# Altium project STM32F407VG.PrjPcb
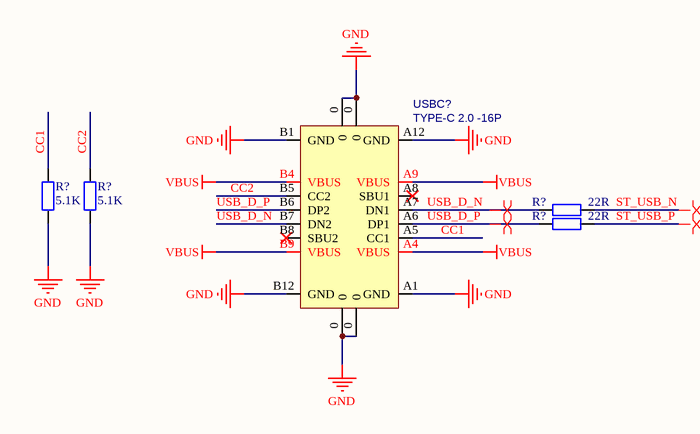
[diagram p0: Power_1.SchDoc]
8 sheets, 75 parts. Net scope: global (net labels, ports and power ports of the same name join across sheets).
Board files: STM32F407VG.PcbDoc, 板框.PcbDoc
Sheets:
  Power_1.SchDoc
  Power_2.SchDoc
  STM32F407VG_A.SchDoc
  STM32F407VG_B.SchDoc
  Flash.SchDoc
  SDCard.SchDoc
  ICM20608.SchDoc
  LCD_ADS131A04.SchDoc

## Sheet Power_1.SchDoc
size A4; SheetNumber: 1; SheetTotal: 8

### Parts
(Parts that share a designator on the sheet are numbered #1, #2 ... from top to bottom, then left to right.)
R?#1  22R  [R0402_L]
R?#2  5.1K  [R0402_L]
R?#3  5.1K  [R0402_L]
R?#4  22R  [R0402_L]
USBC?  TYPE-C 2.0 -16P  [USB-C-SMD_16P]

### Nets
GND: R?#2.1 R?#3.1 USBC?.0 USBC?.A1(GND) USBC?.A12(GND) USBC?.B1(GND) USBC?.B12(GND)
VBUS: USBC?.A4(VBUS) USBC?.A9(VBUS) USBC?.B4(VBUS) USBC?.B9(VBUS)
CC1: R?#2.2 USBC?.A5(CC1)
CC2: R?#3.2 USBC?.B5(CC2)
ST_USB_N: R?#1.2
ST_USB_P: R?#4.2
USB_D_N: R?#1.1 USBC?.A7(DN1) USBC?.B7(DN2)
USB_D_P: R?#4.1 USBC?.A6(DP1) USBC?.B6(DP2)

Not connected (* = marked no-connect by the designer): USBC? A8(SBU1)* B8(SBU2)*

### Layout directives
differential pair: ST_USB_N, ST_USB_P, USB_D_N, USB_D_P

### Library data of the parts
R?#1-R?#4 = R: 贴片电阻; 联系卖家，免费查找封装: 唯一出售店铺网址https://shop463601444.taobao.com; BOM名称: 贴片电阻
USBC? = USB2.0_Type-C_16Pin: USB2.0_Type-C_16Pin母座; 联系卖家 免费查找封装: 唯一出售店铺网址https://shop463601444.taobao.com; 联系卖家 免费技术支持: 封装库来自淘宝卖家ID：黄晶宝石

## Sheet Power_2.SchDoc
size A4; SheetNumber: 2; SheetTotal: 8
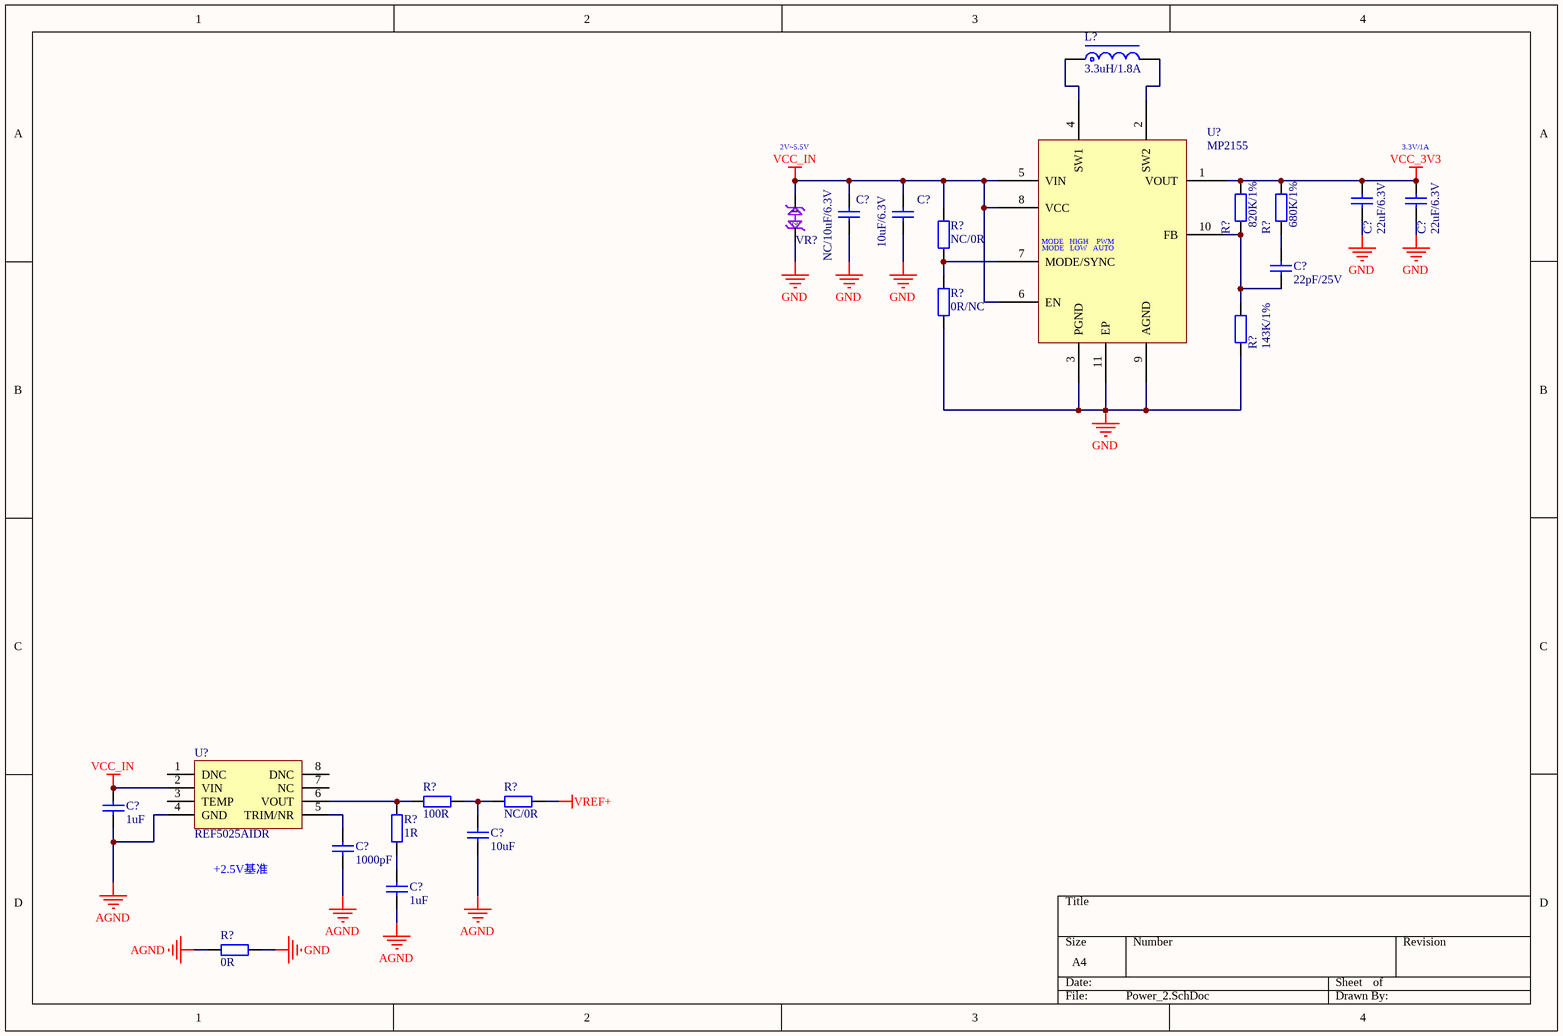
[diagram p1: Power_2.SchDoc]

### Parts
(Parts that share a designator on the sheet are numbered #1, #2 ... from top to bottom, then left to right.)
C?#1  22uF/6.3V  [C0603_L]
C?#2  22uF/6.3V  [C0603_L]
C?#3  NC/10uF/6.3V  [C0603_L]
C?#4  10uF/6.3V  [C0603_L]
C?#5  22pF/25V  [C0402_L]
C?#6  1uF  [C0402_L]
C?#7  10uF  [C0603_L]
C?#8  1000pF  [C0603_L]
C?#9  1uF  [C0402_L]
L?  3.3uH/1.8A  [NR2520]
R?#5  820K/1%  [R0402_L]
R?#6  680K/1%  [R0402_L]
R?#7  NC/0R  [R0402_L]
R?#8  0R/NC  [R0402_L]
R?#9  143K/1%  [R0402_L]
R?#10  100R  [R0402_L]
R?#11  NC/0R  [R0402_L]
R?#12  1R  [R0402_L]
R?#13  0R  [R0402_L]
U?#1  MP2155  [QFN10(3mmX3mm)]
U?#2  REF5025AIDR  [SOIC-8L]
VR?#1  UAD8C05L01  [SOD882]  (value not drawn)

### Nets
AGND: C?#6.1 C?#7.1 C?#8.1 C?#9.1 R?#13.1 U?#2.4(GND)
GND: C?#1.1 C?#2.1 C?#3.1 C?#4.1 R?#8.1 R?#9.1 R?#13.2 U?#1.3(PGND) U?#1.9(AGND) U?#1.11(EP) VR?#1.2
VCC_3V3: C?#1.2 C?#2.2 R?#5.2 R?#6.2 U?#1.1(VOUT)
VCC_IN: C?#3.2 C?#4.2 C?#6.2 R?#7.2 U?#1.5(VIN) U?#1.6(EN) U?#1.8(VCC) U?#2.2(VIN) VR?#1.1
VREF+: R?#11.2
NetC?#5_1: C?#5.1 R?#5.1 R?#9.2 U?#1.10(FB)
NetC?#5_2: C?#5.2 R?#6.1
NetC?#7_2: C?#7.2 R?#10.2 R?#11.1
NetC?#8_2: C?#8.2 U?#2.5(TRIM/NR)
NetC?#9_2: C?#9.2 R?#12.1
NetL?_1: L?.1 U?#1.4(SW1)
NetL?_2: L?.2 U?#1.2(SW2)
NetR?#7_1: R?#7.1 R?#8.2 U?#1.7(MODE/SYNC)
NetR?#10_1: R?#10.1 R?#12.2 U?#2.6(VOUT)

Not connected (* = marked no-connect by the designer): U?#2 1(DNC) 3(TEMP) 7(NC) 8(DNC)

### Notes on the sheet
- 2V~5.5V
- (near C?#2) 3.3V/1A
- (near U?#1) MODE   HIGH    PWM
- (near U?#1) MODE   LOW   AUTO
- +2.5V基准

### Library data of the parts
C?#1-C?#9 = C: 贴片电容; BOM名称: 无极性贴片电容; 联系卖家，免费查找封装: 唯一出售店铺网址https://shop463601444.taobao.com
L? = L-NR: 太诱-NR磁胶电感; BOM名称: NR磁胶电感; 联系卖家，免费查找封装: 唯一出售店铺网址https://shop463601444.taobao.com
R?#5-R?#13 = R: as R?#1 on sheet Power_1; BOM名称: 贴片电阻
U?#1 = MP2155: 高效、低静态电流的Buck-Boost变换器
U?#2 = REF5025AIDR: 3uVpp/V噪声 3ppm/℃漂移 电压基准 0.05%

## Sheet STM32F407VG_A.SchDoc
size A4; SheetNumber: 3; SheetTotal: 8
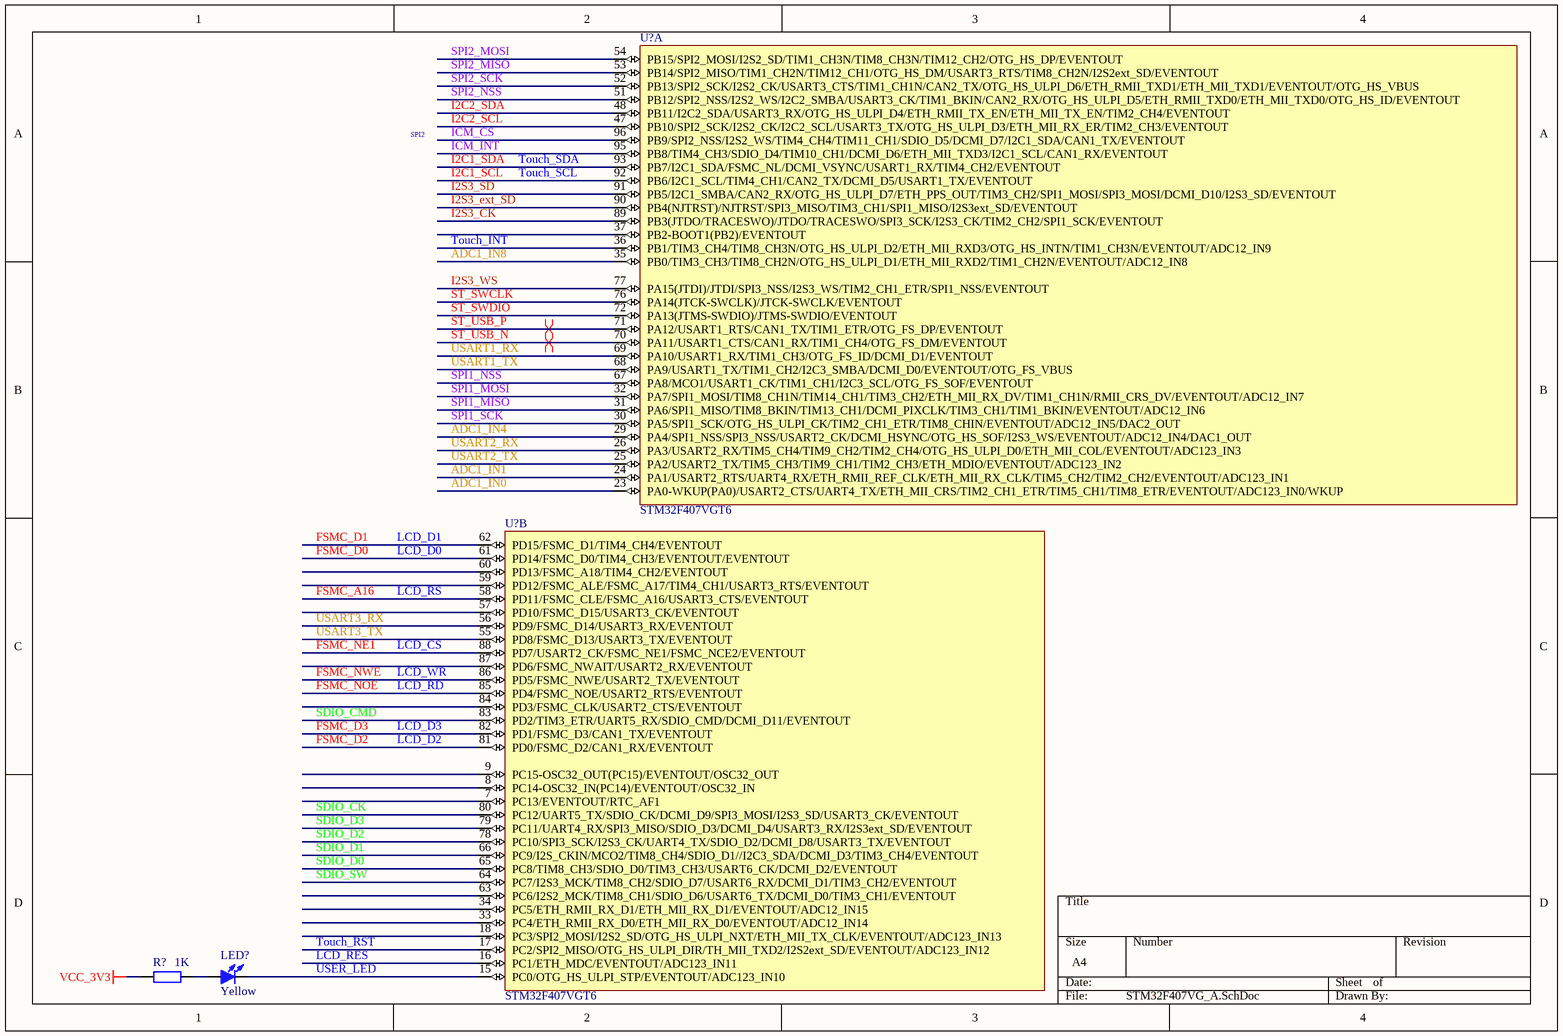
[diagram p2: STM32F407VG_A.SchDoc]

### Parts
(Parts that share a designator on the sheet are numbered #1, #2 ... from top to bottom, then left to right.)
LED?  Yellow  [LED0402]
R?#14  1K  [R0805_L]
U?#3  STM32F407VGT6  [LQFP100_L]  (part A of 5)
U?#4  STM32F407VGT6  [LQFP100_L]  (part B of 5)

### Nets
VCC_3V3: R?#14.1
ADC1_IN0: U?#3.23(PA0-WKUP(PA0)/USART2_CTS/UART4_TX/ETH_MII_CRS/TIM2_CH1_ETR/TIM5_CH1/TIM8_ETR/EVENTOUT/ADC123_IN0/WKUP)
ADC1_IN1: U?#3.24(PA1/USART2_RTS/UART4_RX/ETH_RMII_REF_CLK/ETH_MII_RX_CLK/TIM5_CH2/TIM2_CH2/EVENTOUT/ADC123_IN1)
ADC1_IN4: U?#3.29(PA4/SPI1_NSS/SPI3_NSS/USART2_CK/DCMI_HSYNC/OTG_HS_SOF/I2S3_WS/EVENTOUT/ADC12_IN4/DAC1_OUT)
ADC1_IN8: U?#3.35(PB0/TIM3_CH3/TIM8_CH2N/OTG_HS_ULPI_D1/ETH_MII_RXD2/TIM1_CH2N/EVENTOUT/ADC12_IN8)
FSMC_A16: U?#4.58(PD11/FSMC_CLE/FSMC_A16/USART3_CTS/EVENTOUT)  [also labelled LCD_RS]
FSMC_D0: U?#4.61(PD14/FSMC_D0/TIM4_CH3/EVENTOUT/EVENTOUT)  [also labelled LCD_D0]
FSMC_D1: U?#4.62(PD15/FSMC_D1/TIM4_CH4/EVENTOUT)  [also labelled LCD_D1]
FSMC_D2: U?#4.81(PD0/FSMC_D2/CAN1_RX/EVENTOUT)  [also labelled LCD_D2]
FSMC_D3: U?#4.82(PD1/FSMC_D3/CAN1_TX/EVENTOUT)  [also labelled LCD_D3]
FSMC_NE1: U?#4.88(PD7/USART2_CK/FSMC_NE1/FSMC_NCE2/EVENTOUT)  [also labelled LCD_CS]
FSMC_NOE: U?#4.85(PD4/FSMC_NOE/USART2_RTS/EVENTOUT)  [also labelled LCD_RD]
FSMC_NWE: U?#4.86(PD5/FSMC_NWE/USART2_TX/EVENTOUT)  [also labelled LCD_WR]
I2C1_SCL: U?#3.92(PB6/I2C1_SCL/TIM4_CH1/CAN2_TX/DCMI_D5/USART1_TX/EVENTOUT)  [also labelled Touch_SCL]
I2C1_SDA: U?#3.93(PB7/I2C1_SDA/FSMC_NL/DCMI_VSYNC/USART1_RX/TIM4_CH2/EVENTOUT)  [also labelled Touch_SDA]
I2C2_SCL: U?#3.47(PB10/SPI2_SCK/I2S2_CK/I2C2_SCL/USART3_TX/OTG_HS_ULPI_D3/ETH_MII_RX_ER/TIM2_CH3/EVENTOUT)
I2C2_SDA: U?#3.48(PB11/I2C2_SDA/USART3_RX/OTG_HS_ULPI_D4/ETH_RMII_TX_EN/ETH_MII_TX_EN/TIM2_CH4/EVENTOUT)
I2S3_CK: U?#3.89(PB3(JTDO/TRACESWO)/JTDO/TRACESWO/SPI3_SCK/I2S3_CK/TIM2_CH2/SPI1_SCK/EVENTOUT)
I2S3_ext_SD: U?#3.90(PB4(NJTRST)/NJTRST/SPI3_MISO/TIM3_CH1/SPI1_MISO/I2S3ext_SD/EVENTOUT)
I2S3_SD: U?#3.91(PB5/I2C1_SMBA/CAN2_RX/OTG_HS_ULPI_D7/ETH_PPS_OUT/TIM3_CH2/SPI1_MOSI/SPI3_MOSI/DCMI_D10/I2S3_SD/EVENTOUT)
I2S3_WS: U?#3.77(PA15(JTDI)/JTDI/SPI3_NSS/I2S3_WS/TIM2_CH1_ETR/SPI1_NSS/EVENTOUT)
ICM_CS: U?#3.96(PB9/SPI2_NSS/I2S2_WS/TIM4_CH4/TIM11_CH1/SDIO_D5/DCMI_D7/I2C1_SDA/CAN1_TX/EVENTOUT)
ICM_INT: U?#3.95(PB8/TIM4_CH3/SDIO_D4/TIM10_CH1/DCMI_D6/ETH_MII_TXD3/I2C1_SCL/CAN1_RX/EVENTOUT)
LCD_RES: U?#4.16(PC1/ETH_MDC/EVENTOUT/ADC123_IN11)
SDIO_CK: U?#4.80(PC12/UART5_TX/SDIO_CK/DCMI_D9/SPI3_MOSI/I2S3_SD/USART3_CK/EVENTOUT)
SDIO_CMD: U?#4.83(PD2/TIM3_ETR/UART5_RX/SDIO_CMD/DCMI_D11/EVENTOUT)
SDIO_D0: U?#4.65(PC8/TIM8_CH3/SDIO_D0/TIM3_CH3/USART6_CK/DCMI_D2/EVENTOUT)
SDIO_D1: U?#4.66(PC9/I2S_CKIN/MCO2/TIM8_CH4/SDIO_D1//I2C3_SDA/DCMI_D3/TIM3_CH4/EVENTOUT)
SDIO_D2: U?#4.78(PC10/SPI3_SCK/I2S3_CK/UART4_TX/SDIO_D2/DCMI_D8/USART3_TX/EVENTOUT)
SDIO_D3: U?#4.79(PC11/UART4_RX/SPI3_MISO/SDIO_D3/DCMI_D4/USART3_RX/I2S3ext_SD/EVENTOUT)
SDIO_SW: U?#4.64(PC7/I2S3_MCK/TIM8_CH2/SDIO_D7/USART6_RX/DCMI_D1/TIM3_CH2/EVENTOUT)
SPI1_MISO: U?#3.31(PA6/SPI1_MISO/TIM8_BKIN/TIM13_CH1/DCMI_PIXCLK/TIM3_CH1/TIM1_BKIN/EVENTOUT/ADC12_IN6)
SPI1_MOSI: U?#3.32(PA7/SPI1_MOSI/TIM8_CH1N/TIM14_CH1/TIM3_CH2/ETH_MII_RX_DV/TIM1_CH1N/RMII_CRS_DV/EVENTOUT/ADC12_IN7)
SPI1_NSS: U?#3.67(PA8/MCO1/USART1_CK/TIM1_CH1/I2C3_SCL/OTG_FS_SOF/EVENTOUT)
SPI1_SCK: U?#3.30(PA5/SPI1_SCK/OTG_HS_ULPI_CK/TIM2_CH1_ETR/TIM8_CHIN/EVENTOUT/ADC12_IN5/DAC2_OUT)
SPI2_MISO: U?#3.53(PB14/SPI2_MISO/TIM1_CH2N/TIM12_CH1/OTG_HS_DM/USART3_RTS/TIM8_CH2N/I2S2ext_SD/EVENTOUT)
SPI2_MOSI: U?#3.54(PB15/SPI2_MOSI/I2S2_SD/TIM1_CH3N/TIM8_CH3N/TIM12_CH2/OTG_HS_DP/EVENTOUT)
SPI2_NSS: U?#3.51(PB12/SPI2_NSS/I2S2_WS/I2C2_SMBA/USART3_CK/TIM1_BKIN/CAN2_RX/OTG_HS_ULPI_D5/ETH_RMII_TXD0/ETH_MII_TXD0/OTG_HS_ID/EVENTOUT)
SPI2_SCK: U?#3.52(PB13/SPI2_SCK/I2S2_CK/USART3_CTS/TIM1_CH1N/CAN2_TX/OTG_HS_ULPI_D6/ETH_RMII_TXD1/ETH_MII_TXD1/EVENTOUT/OTG_HS_VBUS)
ST_SWCLK: U?#3.76(PA14(JTCK-SWCLK)/JTCK-SWCLK/EVENTOUT)
ST_SWDIO: U?#3.72(PA13(JTMS-SWDIO)/JTMS-SWDIO/EVENTOUT)
ST_USB_N: U?#3.70(PA11/USART1_CTS/CAN1_RX/TIM1_CH4/OTG_FS_DM/EVENTOUT)
ST_USB_P: U?#3.71(PA12/USART1_RTS/CAN1_TX/TIM1_ETR/OTG_FS_DP/EVENTOUT)
Touch_INT: U?#3.36(PB1/TIM3_CH4/TIM8_CH3N/OTG_HS_ULPI_D2/ETH_MII_RXD3/OTG_HS_INTN/TIM1_CH3N/EVENTOUT/ADC12_IN9)
Touch_RST: U?#4.17(PC2/SPI2_MISO/OTG_HS_ULPI_DIR/TH_MII_TXD2/I2S2ext_SD/EVENTOUT/ADC123_IN12)
USART1_RX: U?#3.69(PA10/USART1_RX/TIM1_CH3/OTG_FS_ID/DCMI_D1/EVENTOUT)
USART1_TX: U?#3.68(PA9/USART1_TX/TIM1_CH2/I2C3_SMBA/DCMI_D0/EVENTOUT/OTG_FS_VBUS)
USART2_RX: U?#3.26(PA3/USART2_RX/TIM5_CH4/TIM9_CH2/TIM2_CH4/OTG_HS_ULPI_D0/ETH_MII_COL/EVENTOUT/ADC123_IN3)
USART2_TX: U?#3.25(PA2/USART2_TX/TIM5_CH3/TIM9_CH1/TIM2_CH3/ETH_MDIO/EVENTOUT/ADC123_IN2)
USART3_RX: U?#4.56(PD9/FSMC_D14/USART3_RX/EVENTOUT)
USART3_TX: U?#4.55(PD8/FSMC_D13/USART3_TX/EVENTOUT)
USER_LED: LED?.2(K) U?#4.15(PC0/OTG_HS_ULPI_STP/EVENTOUT/ADC123_IN10)
NetLED?_1: LED?.1(A) R?#14.2

Not connected (* = marked no-connect by the designer): U?#3 37(PB2-BOOT1(PB2)/EVENTOUT); U?#4 7(PC13/EVENTOUT/RTC_AF1) 8(PC14-OSC32_IN(PC14)/EVENTOUT/OSC32_IN) 9(PC15-OSC32_OUT(PC15)/EVENTOUT/OSC32_OUT) 18(PC3/SPI2_MOSI/I2S2_SD/OTG_HS_ULPI_NXT/ETH_MII_TX_CLK/EVENTOUT/ADC123_IN13) 33(PC4/ETH_RMII_RX_D0/ETH_MII_RX_D0/EVENTOUT/ADC12_IN14) 34(PC5/ETH_RMII_RX_D1/ETH_MII_RX_D1/EVENTOUT/ADC12_IN15) 57(PD10/FSMC_D15/USART3_CK/EVENTOUT) 59(PD12/FSMC_ALE/FSMC_A17/TIM4_CH1/USART3_RTS/EVENTOUT) 60(PD13/FSMC_A18/TIM4_CH2/EVENTOUT) 63(PC6/I2S2_MCK/TIM8_CH1/SDIO_D6/USART6_TX/DCMI_D0/TIM3_CH1/EVENTOUT) 84(PD3/FSMC_CLK/USART2_CTS/EVENTOUT) 87(PD6/FSMC_NWAIT/USART2_RX/EVENTOUT)

### Layout directives
differential pair: ST_USB_N, ST_USB_P

### Notes on the sheet
- SPI2

### Library data of the parts
LED? = LED-SMD: 贴片LED; 联系卖家 免费查找封装: 封装库来自淘宝卖家ID：黄晶宝石; BOM名称: 贴片LED
R?#14 = R: as R?#1 on sheet Power_1; BOM名称: 贴片电阻
U?#3 U?#4 = STM32F407VGT6: ARM Cortex-M4 32b MCU+FPU, 210DMIP, 1024 kB Flash, 192+4 kB RAM, Camera, 82 I/Os, 100-pin LQFP, -40 to +85癈, Tray; Internal RAM: 192kB; Operating Frequency (Processor Speed): 168MHz; A/D Converter: 16x12-bit; D/A Converter: 2x12-bit; 16-bit Timers (IC/OC/PWM): 12x16-bit(24/24/30); 32-bit Timer (IC/OC/PWM): 2x32-bit (8/8/8); Other Timer Functions: 2xWDG, RTC, 24-bit down counter; Serial Interface: 3xSPI/2xI2S/2xI2C/3xUSART(IrDa, ISO7816)/3xUART/2xUSB OTG FS/HS, 2xCAN/Ethernet MAC10/100, SDIO; 联系卖家，免费查找封装: 唯一出售店铺网址https://shop463601444.taobao.com; DatasheetVersion: rev2, Jan-2012; PackageVersion: 2012; PackageReference: LQFP100; PackageDescription: 100-Pin Low Profile Quad Flat Package, 14x14 mm Body, 0.5 mm Pitch; ComponentLink1Description: Manufacturer URL; ComponentLink1URL: http://www.st.com/; ComponentLink2Description: STM32F405/7 Datasheet; ComponentLink2URL: http://www.st.com/internet/com/TECHNICAL_RESOURCES/TECHNICAL_LITERATURE/DATASHEET/DM00037051.pdf; ComponentLink3Description: STM32F4 Web Page; ComponentLink3URL: http://www.st.com/internet/mcu/subclass/1521.jsp

## Sheet STM32F407VG_B.SchDoc
size A4; SheetNumber: 4; SheetTotal: 8
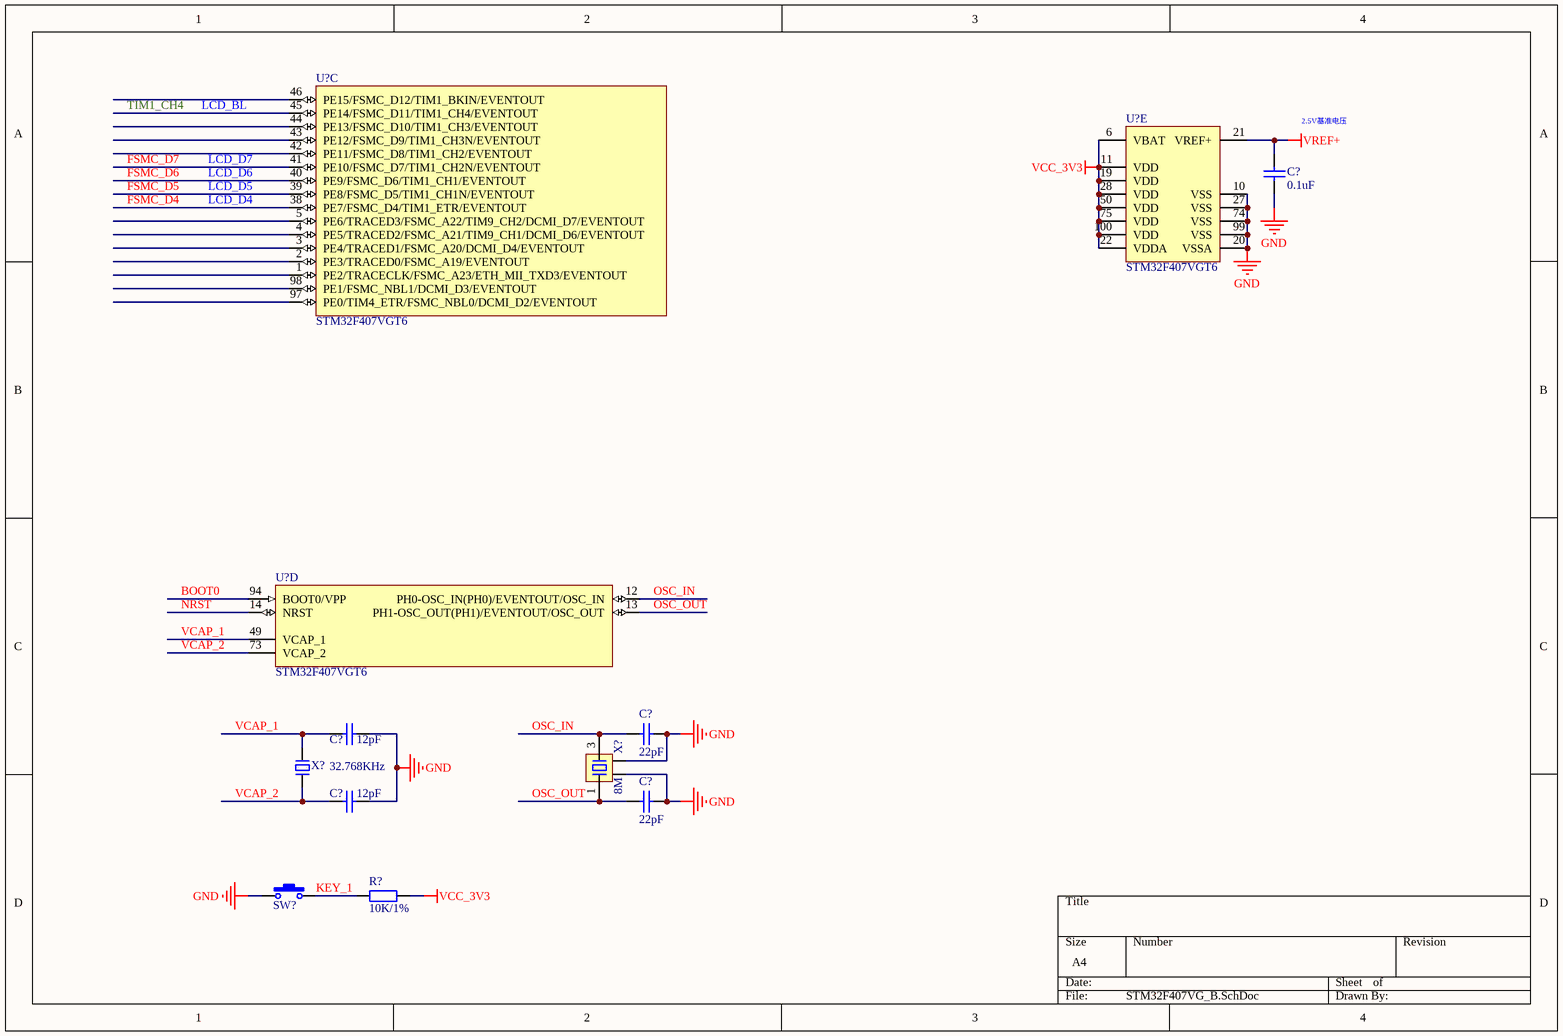
[diagram p3: STM32F407VG_B.SchDoc]

### Parts
(Parts that share a designator on the sheet are numbered #1, #2 ... from top to bottom, then left to right.)
C?#10  0.1uF  [C0402_L]
C?#11  12pF  [C0402_L]
C?#12  22pF  [C0402_L]
C?#13  12pF  [C0402_L]
C?#14  22pF  [C0402_L]
R?#15  10K/1%  [R0402_L]
SW?  小龟按键  [3*4两脚小龟按键]  (value not drawn)
U?#5  STM32F407VGT6  [LQFP100_L]  (part E of 5)
U?#6  STM32F407VGT6  [LQFP100_L]  (part C of 5)
U?#7  STM32F407VGT6  [LQFP100_L]  (part D of 5)
X?#1  32.768KHz  [XTAL-3215-2P]
X?#2  8M  [XTAL-3225-4P]

### Nets
GND: C?#10.1 C?#11.1 C?#12.2 C?#13.1 C?#14.2 SW?.1 U?#5.10(VSS) U?#5.20(VSSA) U?#5.27(VSS) U?#5.74(VSS) U?#5.99(VSS) X?#2.2 X?#2.4
VCC_3V3: R?#15.2 U?#5.6(VBAT) U?#5.11(VDD) U?#5.19(VDD) U?#5.22(VDDA) U?#5.28(VDD) U?#5.50(VDD) U?#5.75(VDD) U?#5.100(VDD)
VREF+: C?#10.2 U?#5.21(VREF+)
BOOT0: U?#7.94(BOOT0/VPP)
FSMC_D4: U?#6.38(PE7/FSMC_D4/TIM1_ETR/EVENTOUT)  [also labelled LCD_D4]
FSMC_D5: U?#6.39(PE8/FSMC_D5/TIM1_CH1N/EVENTOUT)  [also labelled LCD_D5]
FSMC_D6: U?#6.40(PE9/FSMC_D6/TIM1_CH1/EVENTOUT)  [also labelled LCD_D6]
FSMC_D7: U?#6.41(PE10/FSMC_D7/TIM1_CH2N/EVENTOUT)  [also labelled LCD_D7]
KEY_1: R?#15.1 SW?.2
LCD_BL: U?#6.45(PE14/FSMC_D11/TIM1_CH4/EVENTOUT)  [also labelled TIM1_CH4]
NRST: U?#7.14(NRST)
OSC_IN: C?#12.1 U?#7.12(PH0-OSC_IN(PH0)/EVENTOUT/OSC_IN) X?#2.3
OSC_OUT: C?#14.1 U?#7.13(PH1-OSC_OUT(PH1)/EVENTOUT/OSC_OUT) X?#2.1
VCAP_1: C?#11.2 U?#7.49(VCAP_1) X?#1.2
VCAP_2: C?#13.2 U?#7.73(VCAP_2) X?#1.1

Not connected (* = marked no-connect by the designer): U?#6 1(PE2/TRACECLK/FSMC_A23/ETH_MII_TXD3/EVENTOUT) 2(PE3/TRACED0/FSMC_A19/EVENTOUT) 3(PE4/TRACED1/FSMC_A20/DCMI_D4/EVENTOUT) 4(PE5/TRACED2/FSMC_A21/TIM9_CH1/DCMI_D6/EVENTOUT) 5(PE6/TRACED3/FSMC_A22/TIM9_CH2/DCMI_D7/EVENTOUT) 42(PE11/FSMC_D8/TIM1_CH2/EVENTOUT) 43(PE12/FSMC_D9/TIM1_CH3N/EVENTOUT) 44(PE13/FSMC_D10/TIM1_CH3/EVENTOUT) 46(PE15/FSMC_D12/TIM1_BKIN/EVENTOUT) 97(PE0/TIM4_ETR/FSMC_NBL0/DCMI_D2/EVENTOUT) 98(PE1/FSMC_NBL1/DCMI_D3/EVENTOUT)

### Notes on the sheet
- (near C?#10) 2.5V基准电压

### Library data of the parts
C?#10-C?#14 = C: as C?#1 on sheet Power_2
R?#15 = R: as R?#1 on sheet Power_1; BOM名称: 贴片电阻
SW? = SW-PB: 微动开关; BOM名称: 3x6轻触开关; 联系卖家，免费查找封装: 唯一出售店铺网址https://shop463601444.taobao.com; 封装库来自淘宝卖家ID：黄晶宝石: 其他店铺购入均为盗版假冒封装库，请立即申请退款
U?#5-U?#7 = STM32F407VGT6: as U?#3 on sheet STM32F407VG_A; DatasheetVersion: rev2, Jan-2012; PackageVersion: 2012; PackageReference: LQFP100; PackageDescription: 100-Pin Low Profile Quad Flat Package, 14x14 mm Body, 0.5 mm Pitch; ComponentLink1Description: Manufacturer URL; ComponentLink1URL: http://www.st.com/; ComponentLink2Description: STM32F405/7 Datasheet; ComponentLink2URL: http://www.st.com/internet/com/TECHNICAL_RESOURCES/TECHNICAL_LITERATURE/DATASHEET/DM00037051.pdf; ComponentLink3Description: STM32F4 Web Page; ComponentLink3URL: http://www.st.com/internet/mcu/subclass/1521.jsp
X?#1 = XTAL-2P: 2脚无源晶振(谐振器）; 联系卖家，免费查找封装: 唯一出售店铺网址https://shop463601444.taobao.com; BOM名称: 2脚无源晶振(谐振器）
X?#2 = XTAL-4P: 4脚无源晶振(谐振器）; 联系卖家，免费查找封装: 唯一出售店铺网址https://shop463601444.taobao.com; BOM名称: 4脚无源晶振(谐振器）

## Sheet Flash.SchDoc
size A4; SheetNumber: 5; SheetTotal: 8
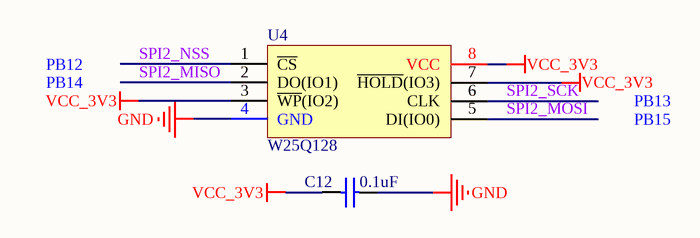
[diagram p4: Flash.SchDoc]

### Parts
C12  0.1uF  [C0402_L]
U4  W25Q128  [WSON 6x5mm]

### Nets
GND: C12.1 U4.4(GND)
VCC_3V3: C12.2 U4.3(~{WP}(IO2)) U4.7(~{HOLD}(IO3)) U4.8(VCC)
SPI2_MISO: U4.2(DO(IO1))
SPI2_MOSI: U4.5(DI(IO0))
SPI2_NSS: U4.1(~{CS})
SPI2_SCK: U4.6(CLK)

### Notes on the sheet
- PB14
- PB12
- PB15
- PB13

### Library data of the parts
C12 = C: as C?#1 on sheet Power_2
U4 = W25Qxx: SPI Flash

## Sheet SDCard.SchDoc
size A4; SheetNumber: 6; SheetTotal: 8
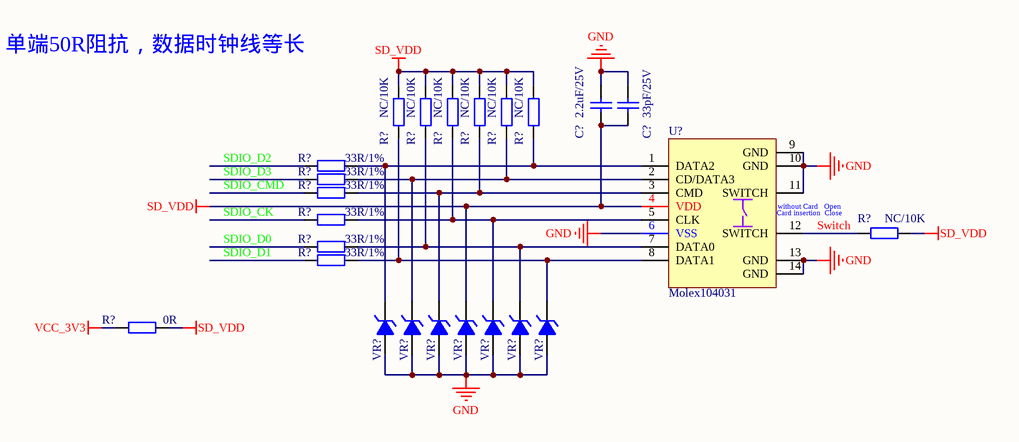
[diagram p5: SDCard.SchDoc]

### Parts
(Parts that share a designator on the sheet are numbered #1, #2 ... from top to bottom, then left to right.)
C?#15  2.2uF/25V  [C0402_L]
C?#16  33pF/25V  [C0402_L]
R?#16  NC/10K  [R0402_L]
R?#17  NC/10K  [R0402_L]
R?#18  NC/10K  [R0402_L]
R?#19  NC/10K  [R0402_L]
R?#20  NC/10K  [R0402_L]
R?#21  NC/10K  [R0402_L]
R?#22  33R/1%  [R0402_L]
R?#23  33R/1%  [R0402_L]
R?#24  33R/1%  [R0402_L]
R?#25  33R/1%  [R0402_L]
R?#26  NC/10K  [R0402_L]
R?#27  33R/1%  [R0402_L]
R?#28  33R/1%  [R0402_L]
R?#29  0R  [R0402_L]
U?#8  Molex104031  [插拔式MicroSD卡]
VR?#2  ESD9D5U  [SOD-923]  (value not drawn)
VR?#3  ESD9D5U  [SOD-923]  (value not drawn)
VR?#4  ESD9D5U  [SOD-923]  (value not drawn)
VR?#5  ESD9D5U  [SOD-923]  (value not drawn)
VR?#6  ESD9D5U  [SOD-923]  (value not drawn)
VR?#7  ESD9D5U  [SOD-923]  (value not drawn)
VR?#8  ESD9D5U  [SOD-923]  (value not drawn)

### Nets
GND: C?#15.2 C?#16.2 U?#8.6(VSS) U?#8.9(GND) U?#8.10(GND) U?#8.11(SWITCH) U?#8.13(GND) U?#8.14(GND) VR?#2.2(A) VR?#3.2(A) VR?#4.2(A) VR?#5.2(A) VR?#6.2(A) VR?#7.2(A) VR?#8.2(A)
SD_VDD: C?#15.1 C?#16.1 R?#16.2 R?#17.2 R?#18.2 R?#19.2 R?#20.2 R?#21.2 R?#26.1 R?#29.2 U?#8.4(VDD) VR?#5.1(K)
VCC_3V3: R?#29.1
SDIO_CK: R?#25.1
SDIO_CMD: R?#24.1
SDIO_D0: R?#27.1
SDIO_D1: R?#28.1
SDIO_D2: R?#22.1
SDIO_D3: R?#23.1
Switch: R?#26.2 U?#8.12(SWITCH)
NetR?#16_1: R?#16.1 R?#28.2 U?#8.8(DATA1) VR?#8.1(K)
NetR?#17_1: R?#17.1 R?#27.2 U?#8.7(DATA0) VR?#7.1(K)
NetR?#18_1: R?#18.1 R?#25.2 U?#8.5(CLK) VR?#6.1(K)
NetR?#19_1: R?#19.1 R?#24.2 U?#8.3(CMD) VR?#4.1(K)
NetR?#20_1: R?#20.1 R?#23.2 U?#8.2(CD/DATA3) VR?#3.1(K)
NetR?#21_1: R?#21.1 R?#22.2 U?#8.1(DATA2) VR?#2.1(K)

### Notes on the sheet
- 单端50R阻抗，数据时钟线等长
- (near U?#8) without Card   Open
- (near U?#8) Card insertion  Close

### Library data of the parts
C?#15 C?#16 = C: as C?#1 on sheet Power_2
R?#16-R?#29 = R: as R?#1 on sheet Power_1; BOM名称: 贴片电阻
U?#8 = Molex104031: 拔插式超薄TF卡座
VR?#2-VR?#8 = Diode4: 瞬态电压抑制二极管

## Sheet ICM20608.SchDoc
size A4; SheetNumber: 7; SheetTotal: 8
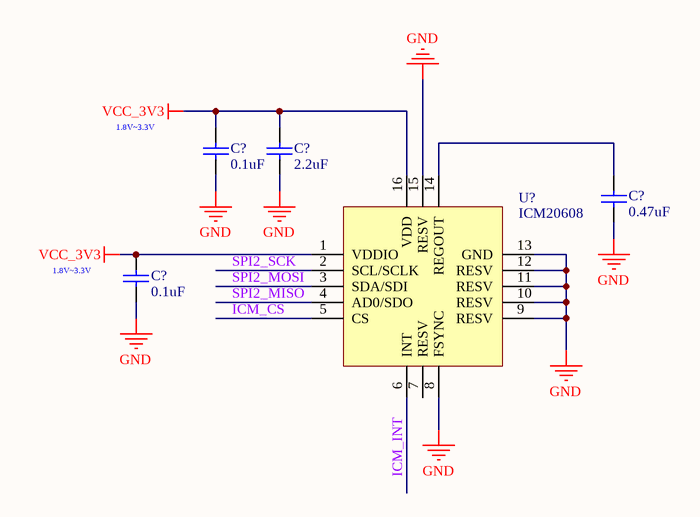
[diagram p6: ICM20608.SchDoc]

### Parts
(Parts that share a designator on the sheet are numbered #1, #2 ... from top to bottom, then left to right.)
C?#17  0.1uF  [C0402_L]
C?#18  2.2uF  [C0402_L]
C?#19  0.47uF  [C0402_L]
C?#20  0.1uF  [C0402_L]
U?#9  ICM20608  [LGA16     3*3*0.75]

### Nets
GND: C?#17.1 C?#18.1 C?#19.2 C?#20.2 U?#9.8(FSYNC) U?#9.9(RESV) U?#9.10(RESV) U?#9.11(RESV) U?#9.12(RESV) U?#9.13(GND) U?#9.15(RESV)
VCC_3V3: C?#17.2 C?#18.2 C?#20.1 U?#9.1(VDDIO) U?#9.16(VDD)
ICM_CS: U?#9.5(CS)
ICM_INT: U?#9.6(INT)
SPI2_MISO: U?#9.4(AD0/SDO)
SPI2_MOSI: U?#9.3(SDA/SDI)
SPI2_SCK: U?#9.2(SCL/SCLK)
NetC?#19_1: C?#19.1 U?#9.14(REGOUT)

Not connected (* = marked no-connect by the designer): U?#9 7(RESV)

### Notes on the sheet
- (near C?#17) 1.8V~3.3V
- (near C?#20) 1.8V~3.3V

### Library data of the parts
C?#17-C?#20 = C: as C?#1 on sheet Power_2
U?#9 = ICM20608-G: 六轴姿态传感器

## Sheet LCD_ADS131A04.SchDoc
size A4; SheetNumber: 8; SheetTotal: 8
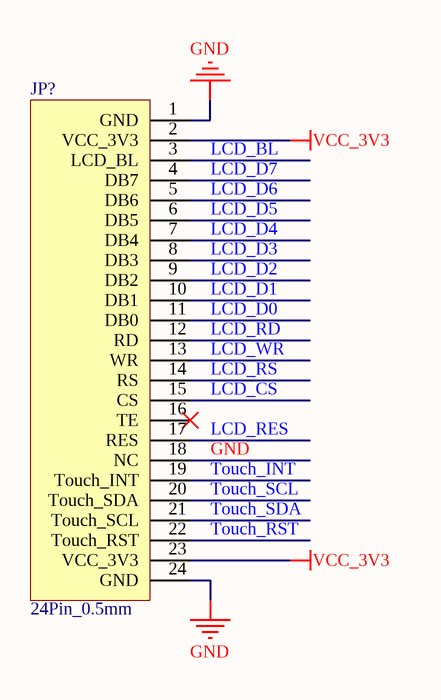
[diagram p7: LCD_ADS131A04.SchDoc]

### Parts
JP?  24Pin_0.5mm  [FPC0.5-WT-24P]

### Nets
GND: JP?.1(GND) JP?.18(NC) JP?.24(GND)
VCC_3V3: JP?.2(VCC_3V3) JP?.23(VCC_3V3)
LCD_BL: JP?.3(LCD_BL)
LCD_CS: JP?.15(CS)  [project net FSMC_NE1]
LCD_D0: JP?.11(DB0)  [project net FSMC_D0]
LCD_D1: JP?.10(DB1)  [project net FSMC_D1]
LCD_D2: JP?.9(DB2)  [project net FSMC_D2]
LCD_D3: JP?.8(DB3)  [project net FSMC_D3]
LCD_D4: JP?.7(DB4)  [project net FSMC_D4]
LCD_D5: JP?.6(DB5)  [project net FSMC_D5]
LCD_D6: JP?.5(DB6)  [project net FSMC_D6]
LCD_D7: JP?.4(DB7)  [project net FSMC_D7]
LCD_RD: JP?.12(RD)  [project net FSMC_NOE]
LCD_RES: JP?.17(RES)
LCD_RS: JP?.14(RS)  [project net FSMC_A16]
LCD_WR: JP?.13(WR)  [project net FSMC_NWE]
Touch_INT: JP?.19(Touch_INT)
Touch_RST: JP?.22(Touch_RST)
Touch_SCL: JP?.20(Touch_SDA)  [project net I2C1_SCL]
Touch_SDA: JP?.21(Touch_SCL)  [project net I2C1_SDA]

Not connected (* = marked no-connect by the designer): JP? 16(TE)*

### Library data of the parts
JP? = 屏幕板FPC: 屏幕板外接座

## Nets that join several sheets
GND: Power_1 (7 pins), Power_2 (11 pins), STM32F407VG_B (13 pins), Flash (C12.1 U4.4), SDCard (15 pins), ICM20608 (11 pins), LCD_ADS131A04 (JP?.1 JP?.18 JP?.24)
VCC_3V3: Power_2 (5 pins), STM32F407VG_A (R?#14.1), STM32F407VG_B (9 pins), Flash (C12.2 U4.3 U4.7 U4.8), SDCard (R?#29.1), ICM20608 (5 pins), LCD_ADS131A04 (JP?.2 JP?.23)
VREF+: Power_2 (R?#11.2), STM32F407VG_B (C?#10.2 U?#5.21)
FSMC_A16: STM32F407VG_A (U?#4.58), LCD_ADS131A04 (JP?.14)
FSMC_D0: STM32F407VG_A (U?#4.61), LCD_ADS131A04 (JP?.11)
FSMC_D1: STM32F407VG_A (U?#4.62), LCD_ADS131A04 (JP?.10)
FSMC_D2: STM32F407VG_A (U?#4.81), LCD_ADS131A04 (JP?.9)
FSMC_D3: STM32F407VG_A (U?#4.82), LCD_ADS131A04 (JP?.8)
FSMC_D4: STM32F407VG_B (U?#6.38), LCD_ADS131A04 (JP?.7)
FSMC_D5: STM32F407VG_B (U?#6.39), LCD_ADS131A04 (JP?.6)
FSMC_D6: STM32F407VG_B (U?#6.40), LCD_ADS131A04 (JP?.5)
FSMC_D7: STM32F407VG_B (U?#6.41), LCD_ADS131A04 (JP?.4)
FSMC_NE1: STM32F407VG_A (U?#4.88), LCD_ADS131A04 (JP?.15)
FSMC_NOE: STM32F407VG_A (U?#4.85), LCD_ADS131A04 (JP?.12)
FSMC_NWE: STM32F407VG_A (U?#4.86), LCD_ADS131A04 (JP?.13)
I2C1_SCL: STM32F407VG_A (U?#3.92), LCD_ADS131A04 (JP?.20)
I2C1_SDA: STM32F407VG_A (U?#3.93), LCD_ADS131A04 (JP?.21)
ICM_CS: STM32F407VG_A (U?#3.96), ICM20608 (U?#9.5)
ICM_INT: STM32F407VG_A (U?#3.95), ICM20608 (U?#9.6)
LCD_BL: STM32F407VG_B (U?#6.45), LCD_ADS131A04 (JP?.3)
LCD_RES: STM32F407VG_A (U?#4.16), LCD_ADS131A04 (JP?.17)
SDIO_CK: STM32F407VG_A (U?#4.80), SDCard (R?#25.1)
SDIO_CMD: STM32F407VG_A (U?#4.83), SDCard (R?#24.1)
SDIO_D0: STM32F407VG_A (U?#4.65), SDCard (R?#27.1)
SDIO_D1: STM32F407VG_A (U?#4.66), SDCard (R?#28.1)
SDIO_D2: STM32F407VG_A (U?#4.78), SDCard (R?#22.1)
SDIO_D3: STM32F407VG_A (U?#4.79), SDCard (R?#23.1)
SPI2_MISO: STM32F407VG_A (U?#3.53), Flash (U4.2), ICM20608 (U?#9.4)
SPI2_MOSI: STM32F407VG_A (U?#3.54), Flash (U4.5), ICM20608 (U?#9.3)
SPI2_NSS: STM32F407VG_A (U?#3.51), Flash (U4.1)
SPI2_SCK: STM32F407VG_A (U?#3.52), Flash (U4.6), ICM20608 (U?#9.2)
ST_USB_N: Power_1 (R?#1.2), STM32F407VG_A (U?#3.70)
ST_USB_P: Power_1 (R?#4.2), STM32F407VG_A (U?#3.71)
Touch_INT: STM32F407VG_A (U?#3.36), LCD_ADS131A04 (JP?.19)
Touch_RST: STM32F407VG_A (U?#4.17), LCD_ADS131A04 (JP?.22)